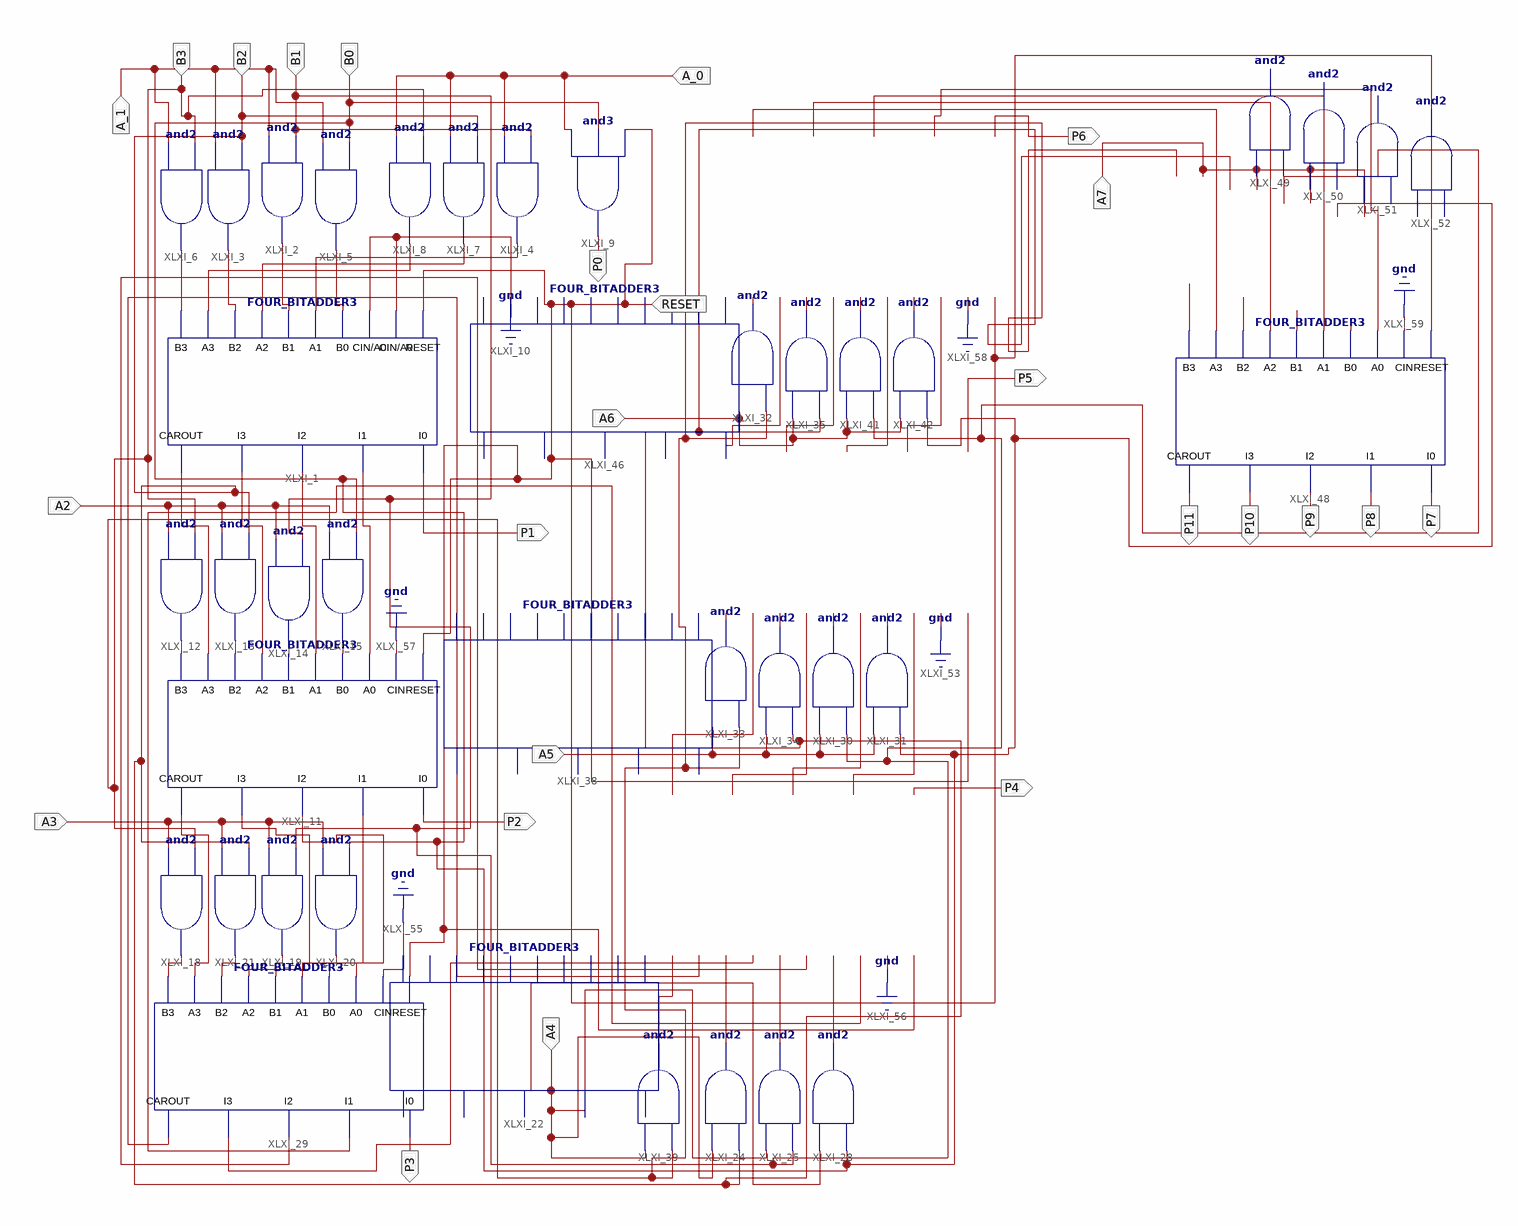
[diagram p0: schematic sheet 1]
// Xilinx ISE schematic EIGHTCROSSFOUR_MULTIPLIER1.sch (artix7) as structural Verilog: 39 symbols, 25 ports
module EIGHTCROSSFOUR_MULTIPLIER1 (
  input  B3,
  input  B1,
  input  B0,
  input  A_1,
  input  A_0,
  input  B2,
  input  A2,
  input  A3,
  input  A4,
  input  A5,
  input  A6,
  input  A7,
  input  RESET,
  output P0,
  output P1,
  output P2,
  output P3,
  output P4,
  output P5,
  output P6,
  output P7,
  output P8,
  output P9,
  output P10,
  output P11
);

  wire XLXN_1, XLXN_2, XLXN_3, XLXN_4, XLXN_5, XLXN_6, XLXN_7, XLXN_34, XLXN_35, XLXN_36, XLXN_37, XLXN_38,
       XLXN_39, XLXN_40, XLXN_41, XLXN_48, XLXN_49, XLXN_50, XLXN_51, XLXN_58, XLXN_65, XLXN_69, XLXN_70,
       XLXN_81, XLXN_82, XLXN_83, XLXN_86, XLXN_87, XLXN_88, XLXN_89, XLXN_113, XLXN_114, XLXN_116, XLXN_117,
       XLXN_118, XLXN_123, XLXN_124, XLXN_125, XLXN_126, XLXN_132, XLXN_134, XLXN_135, XLXN_136, XLXN_149,
       XLXN_150, XLXN_151, XLXN_152, XLXN_165, XLXN_166, XLXN_167, XLXN_168, XLXN_175, XLXN_176, XLXN_177,
       XLXN_179;

  FOUR_BITADDER3 XLXI_1 (
    .RESET(RESET), .CIN(1'b0), .A0(1'b0), .B0(XLXN_4), .A1(XLXN_7), .B1(XLXN_3), .A2(XLXN_6), .B2(XLXN_2),
    .A3(XLXN_5), .B3(XLXN_1), .I0(P1), .I1(XLXN_41), .I2(XLXN_40), .I3(XLXN_39), .CAROUT(XLXN_38));
  and XLXI_2 (XLXN_3, A_1, B1);
  and XLXI_3 (XLXN_2, A_1, B2);
  and XLXI_4 (XLXN_7, A_0, B1);
  and XLXI_5 (XLXN_4, A_1, B0);
  and XLXI_6 (XLXN_1, A_1, B3);
  and XLXI_7 (XLXN_6, A_0, B2);
  and XLXI_8 (XLXN_5, A_0, B3);
  and XLXI_9 (P0, A_0, B0, RESET);
  FOUR_BITADDER3 XLXI_11 (
    .RESET(RESET), .CIN(1'b0), .A0(XLXN_41), .B0(XLXN_37), .A1(XLXN_40), .B1(XLXN_36), .A2(XLXN_39),
    .B2(XLXN_35), .A3(XLXN_38), .B3(XLXN_34), .I0(P2), .I1(XLXN_58), .I2(XLXN_70), .I3(XLXN_65),
    .CAROUT(XLXN_69));
  and XLXI_12 (XLXN_34, A2, B3);
  and XLXI_13 (XLXN_35, A2, B2);
  and XLXI_15 (XLXN_37, A2, B0);
  and XLXI_14 (XLXN_36, A2, B1);
  and XLXI_18 (XLXN_48, A3, B3);
  and XLXI_19 (XLXN_50, A3, B1);
  and XLXI_20 (XLXN_51, A3, B0);
  and XLXI_21 (XLXN_49, A3, B2);
  FOUR_BITADDER3 XLXI_22 (
    .RESET(RESET), .CIN(1'b0), .A0(XLXN_89), .B0(XLXN_83), .A1(XLXN_88), .B1(XLXN_82), .A2(XLXN_87),
    .B2(XLXN_81), .A3(XLXN_86), .B3(XLXN_113), .I0(P4), .I1(XLXN_126), .I2(XLXN_125), .I3(XLXN_124),
    .CAROUT(XLXN_123));
  and XLXI_24 (XLXN_81, B2, A4);
  and XLXI_25 (XLXN_82, B1, A4);
  and XLXI_28 (XLXN_83, B0, A4);
  FOUR_BITADDER3 XLXI_29 (
    .RESET(RESET), .CIN(1'b0), .A0(XLXN_58), .B0(XLXN_51), .A1(XLXN_70), .B1(XLXN_50), .A2(XLXN_65),
    .B2(XLXN_49), .A3(XLXN_69), .B3(XLXN_48), .I0(P3), .I1(XLXN_89), .I2(XLXN_88), .I3(XLXN_87),
    .CAROUT(XLXN_86));
  and XLXI_30 (XLXN_117, B1, A5);
  and XLXI_31 (XLXN_118, B0, A5);
  and XLXI_32 (XLXN_132, B3, A6);
  and XLXI_33 (XLXN_114, B3, A5);
  and XLXI_34 (XLXN_116, B2, A5);
  and XLXI_35 (XLXN_134, B2, A6);
  FOUR_BITADDER3 XLXI_38 (
    .RESET(RESET), .CIN(1'b0), .A0(XLXN_126), .B0(XLXN_118), .A1(XLXN_125), .B1(XLXN_117), .A2(XLXN_124),
    .B2(XLXN_116), .A3(XLXN_123), .B3(XLXN_114), .I0(P5), .I1(XLXN_152), .I2(XLXN_151), .I3(XLXN_150),
    .CAROUT(XLXN_149));
  and XLXI_39 (XLXN_113, B3, A4);
  and XLXI_41 (XLXN_135, B1, A6);
  and XLXI_42 (XLXN_136, B0, A6);
  FOUR_BITADDER3 XLXI_46 (
    .RESET(RESET), .CIN(1'b0), .A0(XLXN_152), .B0(XLXN_136), .A1(XLXN_151), .B1(XLXN_135), .A2(XLXN_150),
    .B2(XLXN_134), .A3(XLXN_149), .B3(XLXN_132), .I0(P6), .I1(XLXN_179), .I2(XLXN_177), .I3(XLXN_176),
    .CAROUT(XLXN_175));
  FOUR_BITADDER3 XLXI_48 (
    .RESET(RESET), .CIN(1'b0), .A0(XLXN_179), .B0(XLXN_168), .A1(XLXN_177), .B1(XLXN_167), .A2(XLXN_176),
    .B2(XLXN_166), .A3(XLXN_175), .B3(XLXN_165), .I0(P7), .I1(P8), .I2(P9), .I3(P10), .CAROUT(P11));
  and XLXI_49 (XLXN_165, A7, B3);
  and XLXI_50 (XLXN_166, A7, B2);
  and XLXI_51 (XLXN_167, A7, B1);
  and XLXI_52 (XLXN_168, A7, B0);
endmodule
